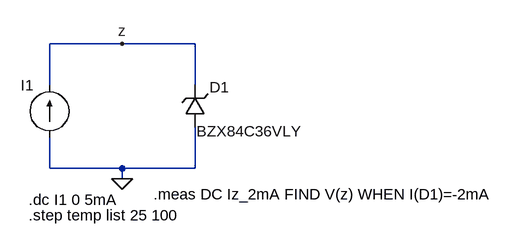
[diagram p0: schematic Zener-VI-6.asc]
Zener-VI-6.asc, the LTspice schematic file:
Version 4
SHEET 1 880 680
WIRE 48 160 -64 160
WIRE 160 160 48 160
WIRE -64 224 -64 160
WIRE 160 224 160 160
WIRE -64 352 -64 304
WIRE 48 352 -64 352
WIRE 160 352 160 288
WIRE 160 352 48 352
WIRE 48 368 48 352
FLAG 48 368 0
FLAG 48 160 z
SYMBOL zener 176 288 R180
WINDOW 0 -37 61 Left 2
WINDOW 3 -149 -7 Left 2
SYMATTR InstName D1
SYMATTR Value BZX84C36VLY
SYMATTR Description Diode
SYMATTR Type diode
SYMBOL current -64 304 R180
WINDOW 0 24 80 Left 2
WINDOW 3 24 0 Invisible 2
WINDOW 123 0 0 Left 2
WINDOW 39 0 0 Left 2
SYMATTR InstName I1
SYMATTR Value 0
TEXT -96 400 Left 2 !.dc I1 0 5mA
TEXT -96 424 Left 2 !.step temp list 25 100
TEXT 96 392 Left 2 !.meas DC Iz_2mA FIND V(z) WHEN I(D1)=-2mA

The netlist it stands for:
* Zener-VI-6.asc
D1 0 z BZX84C36VLY
I1 0 z 0
.model D D
.lib standard.dio
.dc I1 0 5mA
.step temp list 25 100
.meas DC Iz_2mA FIND V(z) WHEN I(D1)=-2mA
.backanno
.end